# EAGLE design SECUREBRD_001 (EAGLE 7.7.0)

## Sheet 1 of 3
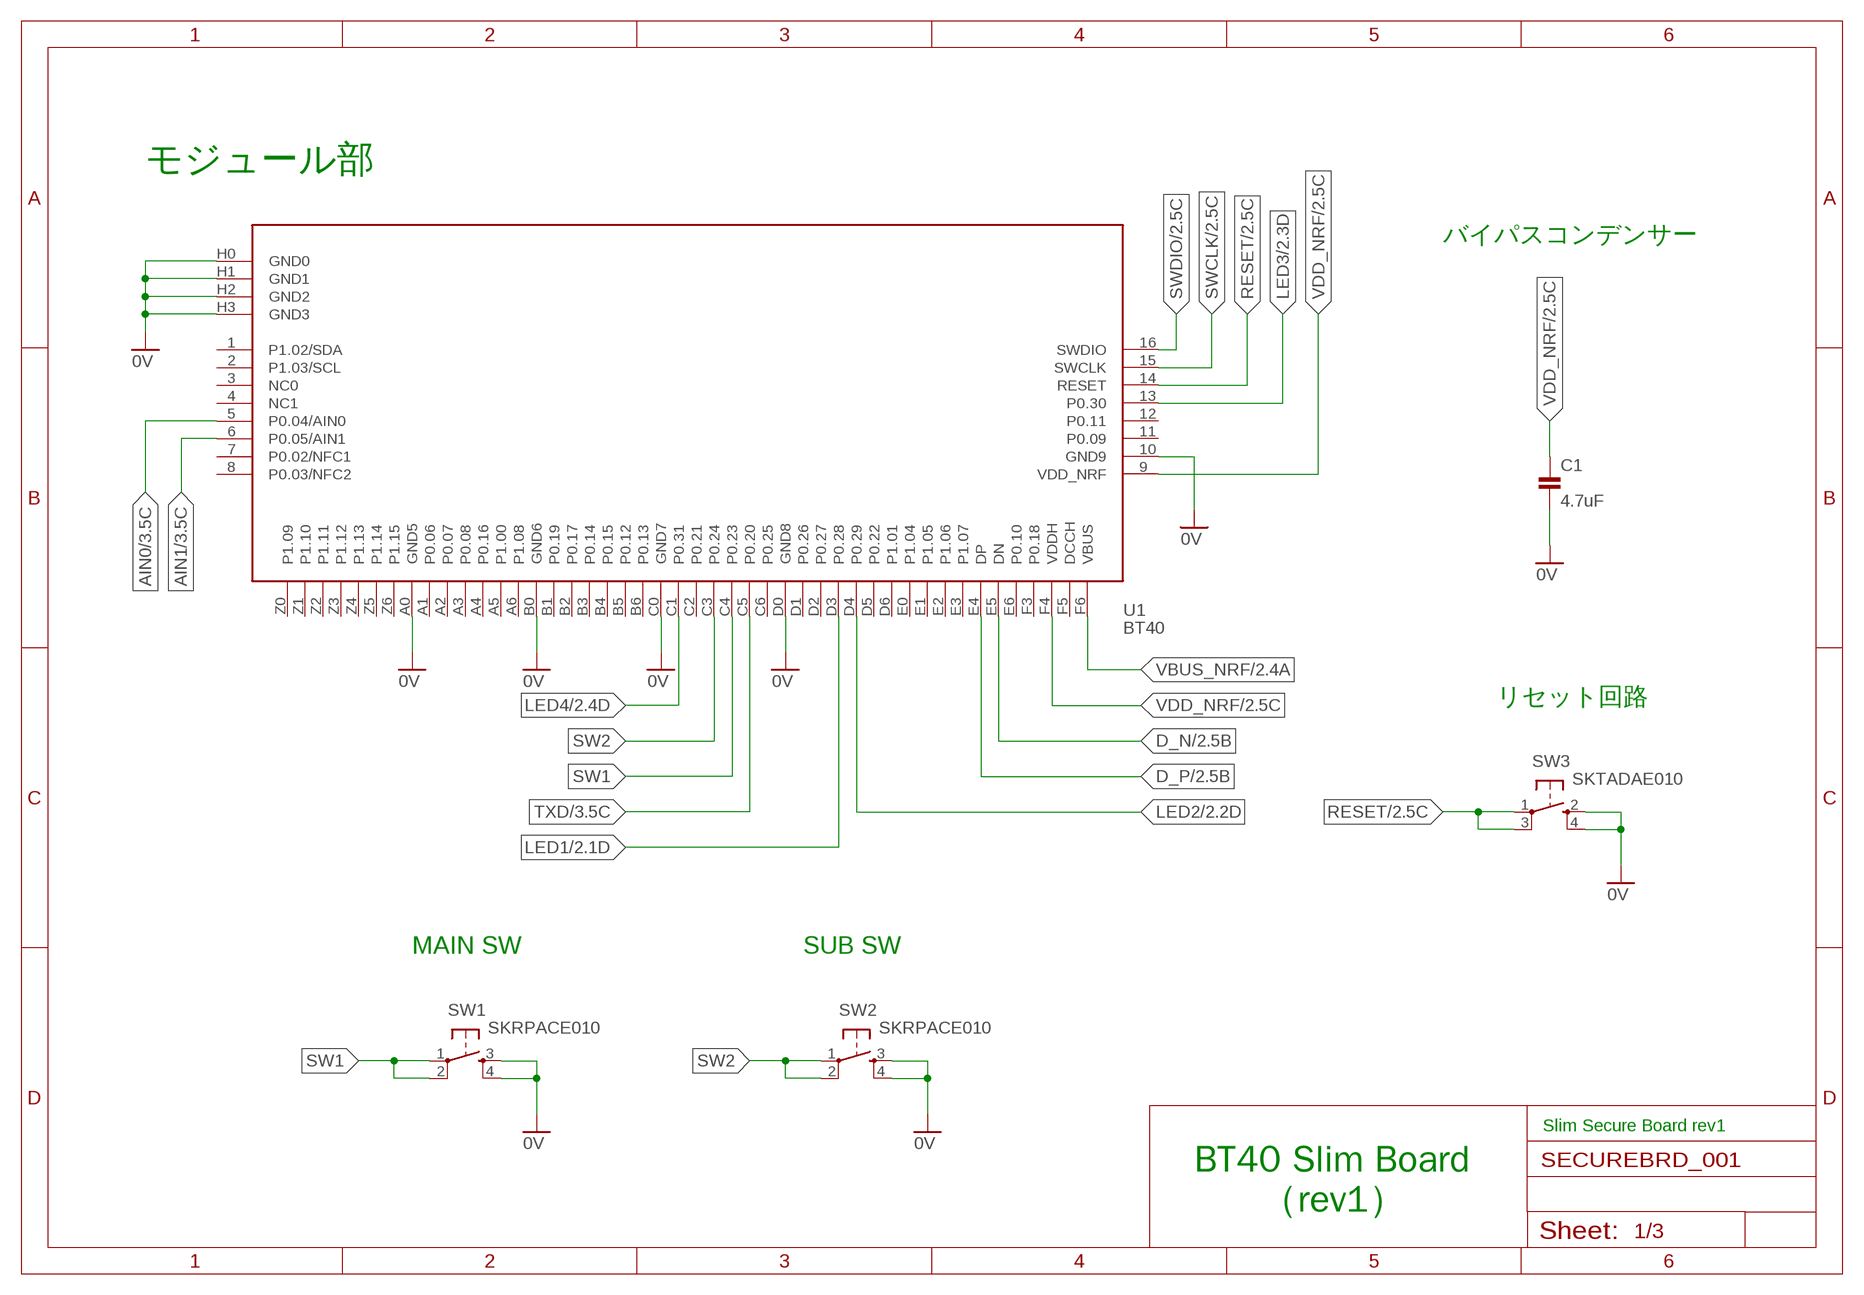
[diagram p0: schematic, sheet 1]

### Parts
C1  4.7uF  CAP_0603  [C0603K]
SW1  SKRPACE010  [SKRPACE010]
SW2  SKRPACE010  [SKRPACE010]
SW3  SKTADAE010  [SKTADAE010]
U1  BT40  [BM40-B_1PRIMARY]

### Nets
0V: C1.2 SW1.3(S) SW1.4(S1) SW2.3(S) SW2.4(S1) SW3.2(S) SW3.4(S1) U1.10(GND9) U1.A0(GND5) U1.B0(GND6) U1.C0(GND7) U1.D0(GND8) U1.H0(GND0) U1.H1(GND1) U1.H2(GND2) U1.H3(GND3) ; also sheet 2,3
AIN0: U1.5(P0.04/AIN0) ; also sheet 3
AIN1: U1.6(P0.05/AIN1) ; also sheet 3
D_N: U1.E5(DN) ; also sheet 2
D_P: U1.E4(DP) ; also sheet 2
LED1: U1.D3(P0.28) ; also sheet 2
LED2: U1.D4(P0.29) ; also sheet 2
LED3: U1.13(P0.30) ; also sheet 2
LED4: U1.C1(P0.31) ; also sheet 2
RESET: SW3.1(P) SW3.3(P1) U1.14(RESET) ; also sheet 2
SW1: SW1.1(P) SW1.2(P1) U1.C4(P0.23)
SW2: SW2.1(P) SW2.2(P1) U1.C3(P0.24)
SWCLK: U1.15(SWCLK) ; also sheet 2
SWDIO: U1.16(SWDIO) ; also sheet 2
TXD: U1.C5(P0.20) ; also sheet 3
VBUS_NRF: U1.F6(VBUS) ; also sheet 2,3
VDD_NRF: C1.1 U1.9(VDD_NRF) U1.F4(VDDH) ; also sheet 2,3
Unconnected: U1.1(P1.02/SDA) U1.2(P1.03/SCL) U1.3(NC0) U1.4(NC1) U1.7(P0.02/NFC1) U1.8(P0.03/NFC2) U1.11(P0.09) U1.12(P0.11) U1.A1(P0.06) U1.A2(P0.07) U1.A3(P0.08) U1.A4(P0.16) U1.A5(P1.00) U1.A6(P1.08) U1.B1(P0.19) U1.B2(P0.17) U1.B3(P0.14) U1.B4(P0.15) U1.B5(P0.12) U1.B6(P0.13) U1.C2(P0.21) U1.C6(P0.25) U1.D1(P0.26) U1.D2(P0.27) U1.D5(P0.22) U1.D6(P1.01) U1.E0(P1.04) U1.E1(P1.05) U1.E2(P1.06) U1.E3(P1.07) U1.E6(P0.10) U1.F3(P0.18) U1.F5(DCCH) U1.Z0(P1.09) U1.Z1(P1.10) U1.Z2(P1.11) U1.Z3(P1.12) U1.Z4(P1.13) U1.Z5(P1.14) U1.Z6(P1.15)

### Notes on the sheet
- モジュール部
- バイパスコンデンサー
- リセット回路
- MAIN SW | SUB SW
- Slim Secure Board rev1
- BT40 Slim Board
        （rev1）

## Sheet 2 of 3
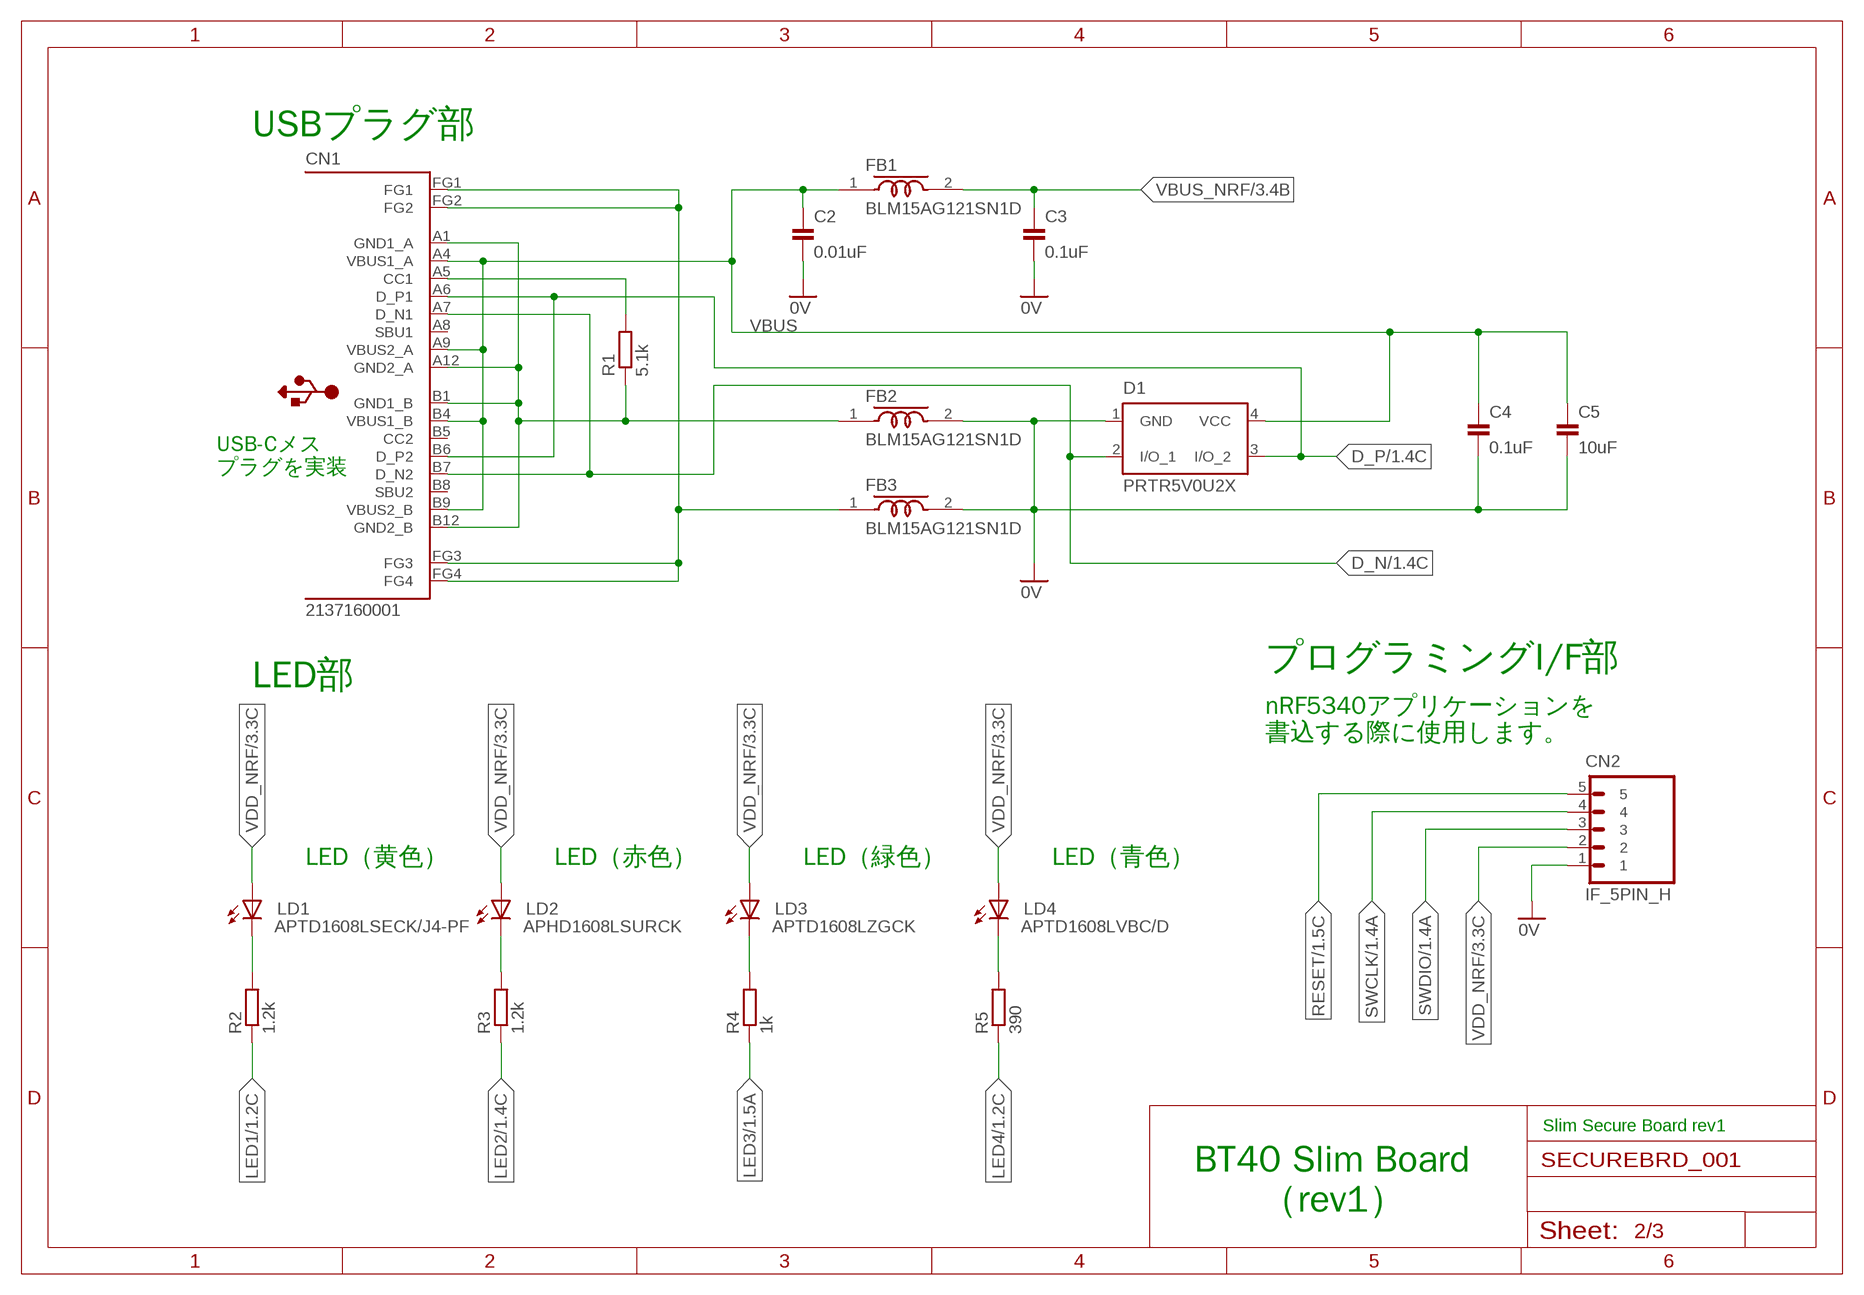
[diagram p1: schematic, sheet 2]

### Parts
C2  0.01uF  CAP_0402K  [C0402K]
C3  0.1uF  CAP_0402K  [C0402K]
C4  0.1uF  CAP_0402K  [C0402K]
C5  10uF  CAP_0603  [C0603K]
CN1  2137160001  [2137160001]
CN2  IF_5PIN_H  [HEADER_5PIN]
D1  PRTR5V0U2X  [SOT143B]
FB1  BLM15AG121SN1D  [C0402K]
FB2  BLM15AG121SN1D  [C0402K]
FB3  BLM15AG121SN1D  [C0402K]
LD1  APTD1608LSECK/J4-PF  [APTD1608]
LD2  APHD1608LSURCK  [APTD1608]
LD3  APTD1608LZGCK  [APTD1608]
LD4  APTD1608LVBC/D  [APTD1608]
R1  5.1k  RESISTOR_0402  [R0402]
R2  1.2k  RESISTOR_0402  [R0402]
R3  1.2k  RESISTOR_0402  [R0402]
R4  1k  RESISTOR_0402  [R0402]
R5  390  RESISTOR_0402  [R0402]

### Nets
0V: C2.2 C3.2 C4.2 C5.2 CN2.1 D1.1(GND) FB2.2 FB3.2 ; also sheet 1,3
D_N: CN1.A7(D_N1) CN1.B7(D_N2) D1.2(I/O_1) ; also sheet 1
D_P: CN1.A6(D_P1) CN1.B6(D_P2) D1.3(I/O_2) ; also sheet 1
FG: CN1.FG1 CN1.FG2 CN1.FG3 CN1.FG4 FB3.1
LED1: R2.1 ; also sheet 1
LED2: R3.1 ; also sheet 1
LED3: R4.1 ; also sheet 1
LED4: R5.1 ; also sheet 1
N$1: LD4.C R5.2
N$2: CN1.A5(CC1) R1.2
N$6: LD3.C R4.2
N$7: LD2.C R3.2
N$8: LD1.C R2.2
RESET: CN2.5 ; also sheet 1
SWCLK: CN2.4 ; also sheet 1
SWDIO: CN2.3 ; also sheet 1
USB_GND: CN1.A1(GND1_A) CN1.A12(GND2_A) CN1.B1(GND1_B) CN1.B12(GND2_B) FB2.1 R1.1
VBUS: C2.1 C4.1 C5.1 CN1.A4(VBUS1_A) CN1.A9(VBUS2_A) CN1.B4(VBUS1_B) CN1.B9(VBUS2_B) D1.4(VCC) FB1.1
VBUS_NRF: C3.1 FB1.2 ; also sheet 1,3
VDD_NRF: CN2.2 LD1.A LD2.A LD3.A LD4.A ; also sheet 1,3
Unconnected: CN1.A8(SBU1) CN1.B5(CC2) CN1.B8(SBU2)

### Notes on the sheet
- USBプラグ部
- USB-Cメス
  プラグを実装
- プログラミングI/F部
- LED部
- nRF5340アプリケーションを
  書込する際に使用します。
- LED（黄色） | LED（赤色） | LED（緑色） | LED（青色）
- Slim Secure Board rev1
- BT40 Slim Board
        （rev1）

## Sheet 3 of 3
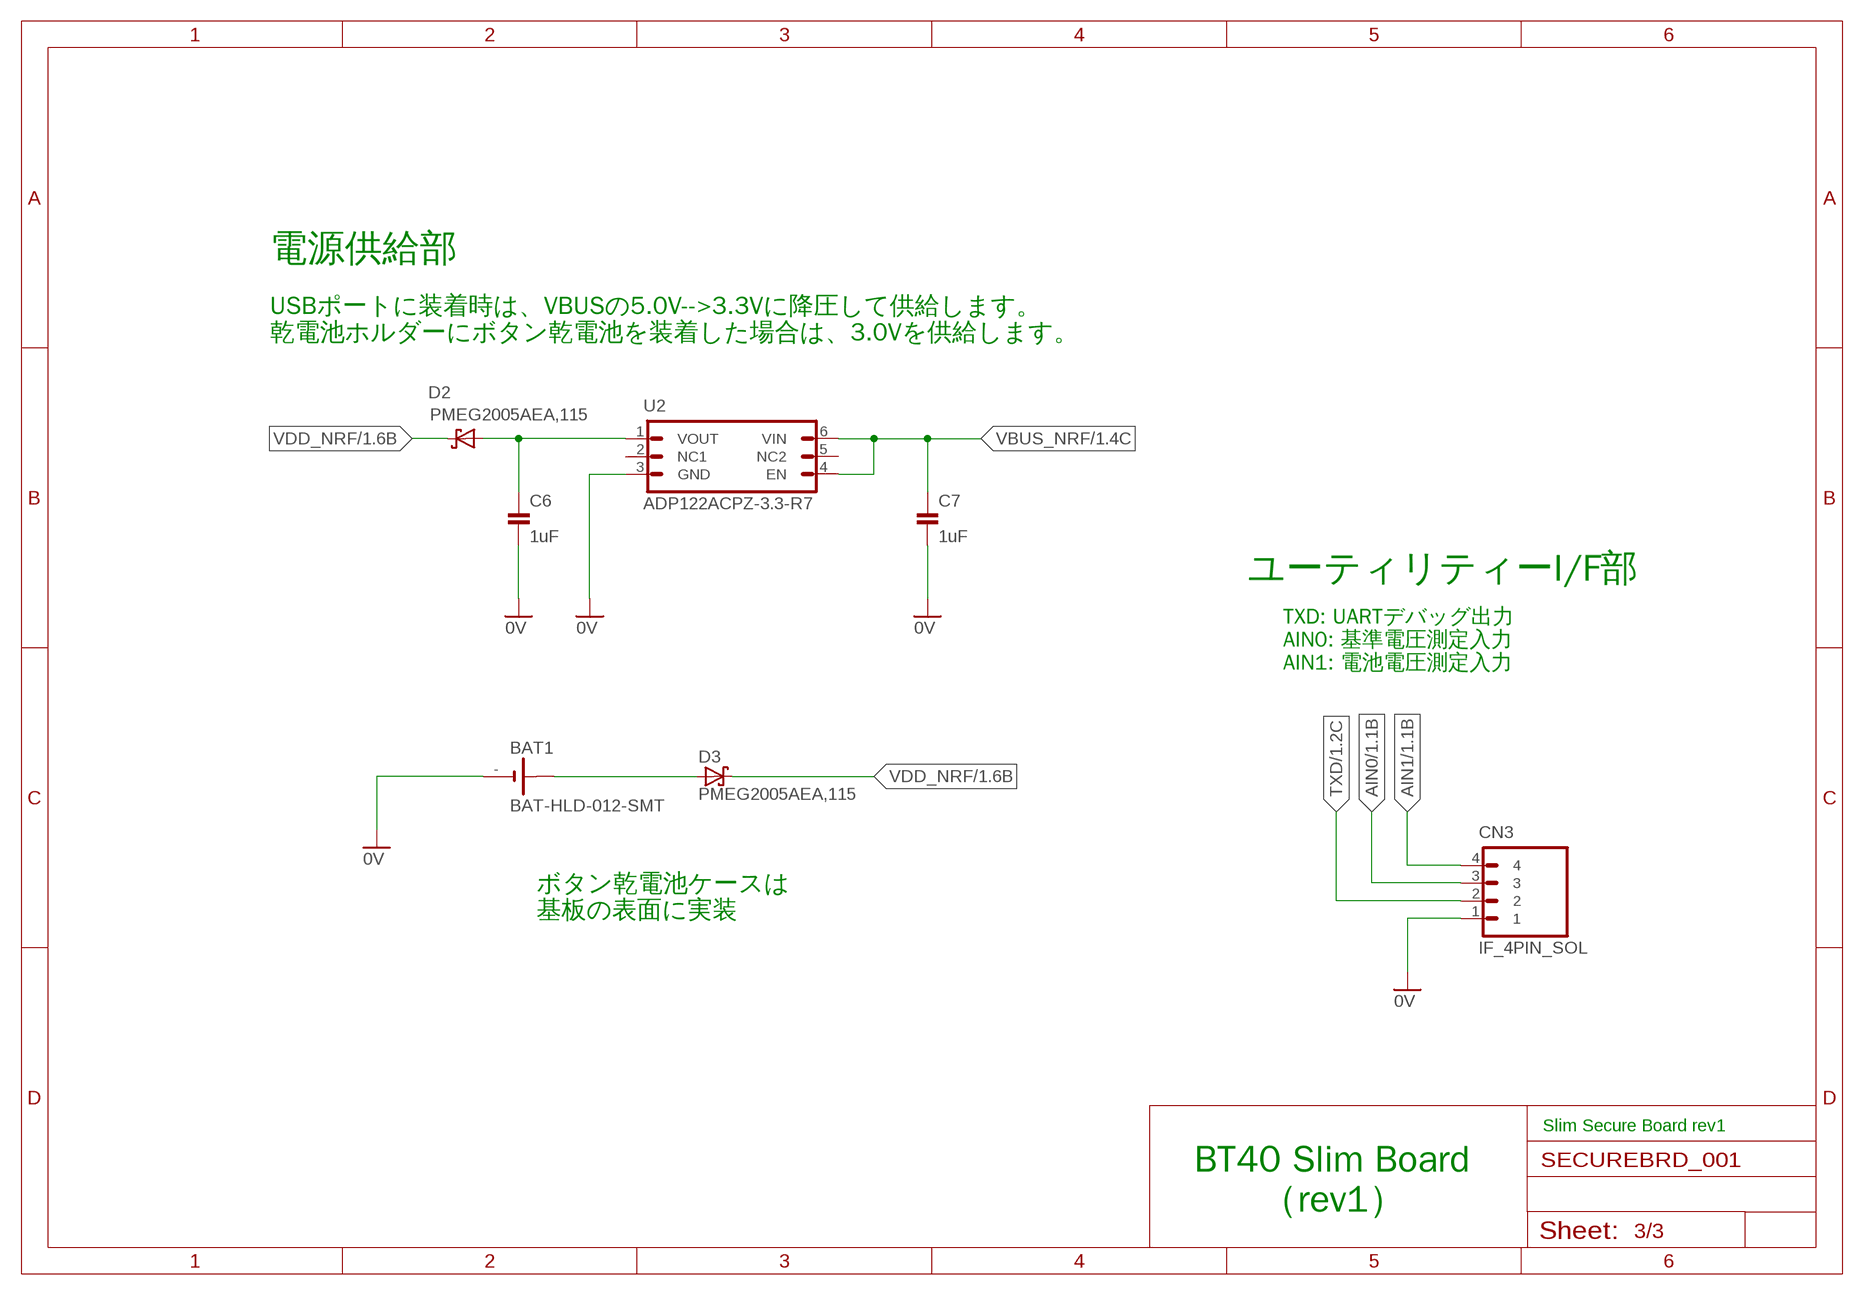
[diagram p2: schematic, sheet 3]

### Parts
BAT1  BAT-HLD-012-SMT  [BAT-HLD-012-SMT]
C6  1uF  CAP_0603  [C0603K]
C7  1uF  CAP_0603  [C0603K]
CN3  IF_4PIN_SOL  [SOLPAD_4PIN]
D2  PMEG2005AEA,115  [SOD323-W]
D3  PMEG2005AEA,115  [SOD323-W]
U2  ADP122ACPZ-3.3-R7  [6-LFCSP_UD]

### Nets
0V: BAT1.- C6.2 C7.2 CN3.1 U2.3(GND) ; also sheet 1,2
AIN0: CN3.3 ; also sheet 1
AIN1: CN3.4 ; also sheet 1
N$3: C6.1 D2.A U2.1(VOUT)
N$5: BAT1.+@2(+) D3.A
TXD: CN3.2 ; also sheet 1
VBUS_NRF: C7.1 U2.4(EN) U2.6(VIN) ; also sheet 1,2
VDD_NRF: D2.C D3.C ; also sheet 1,2
Unconnected: U2.2(NC1) U2.5(NC2)

### Notes on the sheet
- 電源供給部
- USBポートに装着時は、VBUSの5.0V-->3.3Vに降圧して供給します。
  乾電池ホルダーにボタン乾電池を装着した場合は、3.0Vを供給します。
- ユーティリティーI/F部
- TXD: UARTデバッグ出力
  AIN0: 基準電圧測定入力
  AIN1: 電池電圧測定入力
- ボタン乾電池ケースは
  基板の表面に実装
- Slim Secure Board rev1
- BT40 Slim Board
        （rev1）

## Library data of the parts
BAT1 = Connectors:BAT-HLD-012-SMT: ボタン電池ホルダー(CR1216/1225)
C1-C7 = Parts:CAP: コンデンサー
CN1 = Connectors:2137160001: USB Type C Connectors Receptacle USB 2.0 16 Contact
CN2 = Connectors:IF_5PIN: 5-pin インターフェース
CN3 = Connectors:IF_4PIN: 4-pin インターフェース
D1 = Parts:PRTR5V0U2X: ESD protection diode
D2 D3 = Parts:PMEG2005: ショットキーダイオード If - 順電流: 500 mA Vrrm - 繰返し逆電圧: 20 V Vf - 順電圧: 0.39 V Ifsm - 順方向サージ電流: 10 A 最低動作温度: - 65 C 最高動作温度: + 150 C
FB1-FB3 = Parts:BLM15AG: フェライトビーズ EMIFIL®
LD1 LD3 LD4 = Parts:APTD1608: 発光ダイオード
LD2 = Parts:APHD1608: 発光ダイオード
R1-R5 = Parts:RESISTOR: 抵抗器
SW1 SW2 = Parts:SKRPACE010: 表面実装用タクトスイッチ ４．２×３．２ｍｍ小型重作動力タイプ ・作動力：２．５５Ｎ ・操作方向：垂直 ・移動量：０．２ｍｍ ・動作寿命：５０，０００ｃｙｃｌｅｓ （５ｍＡ ５ＶＤＣ） ・初期接触抵抗：最大５００ｍΩ
SW3 = Parts:SKTADAE010: 表面実装用タクトスイッチ 2.6×1.6ｍｍ小型重作動力タイプ ・作動力：2.4 N ・操作方向：垂直 ・移動量：0.11 mm ・定格：50 mA 12 VDC
U1 = Modules:BT40: BLE 5.2, 802.15.4 Modules ・nRF5340 QKAA, dual core ARM® Cortex M33 ・128/64 MHz Cortex M33 with FPU and DSP instructions ・1MB flash, 512KB RAM ・DC-DC converter, inductors for VDD, VDDH on board. ・Direct powered by Lithium batteries or USB supply (up to 5.5V)
U2 = ICs:ADP122: Low Quiescent Current, CMOS Linear Regulator Input voltage supply range: 2.3 V to 5.5 V 300 mA maximum output current Very low dropout voltage: 85 mV at 300 mA load Low quiescent current: 45 μA at no load

## Board
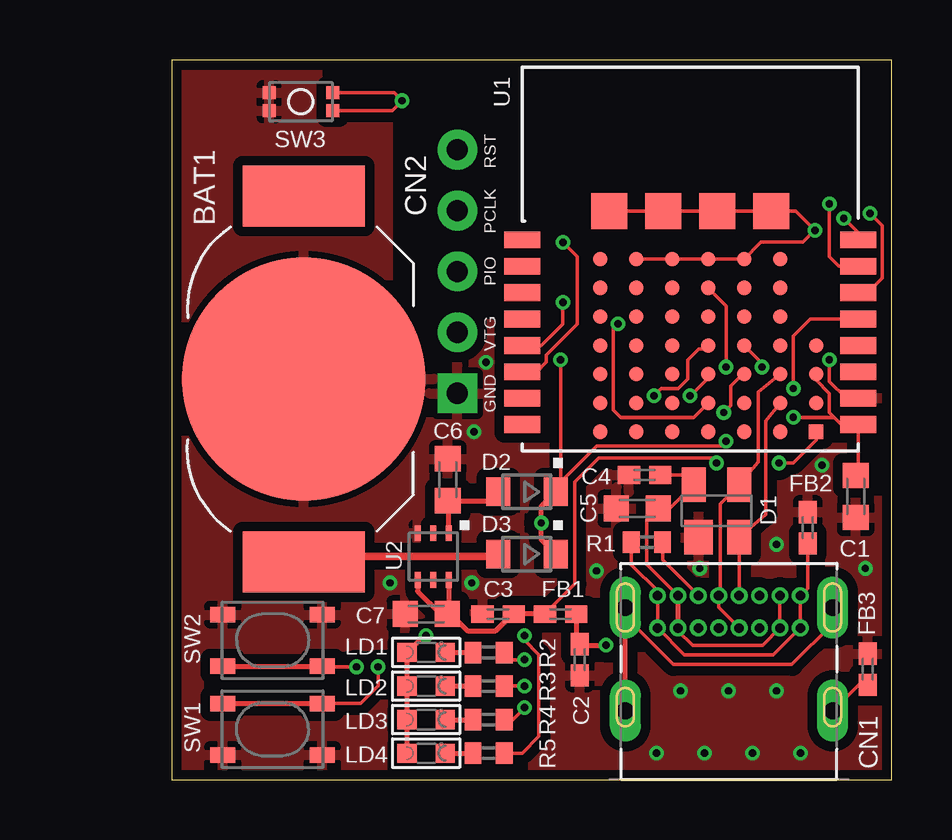
[diagram p3: board, top side]
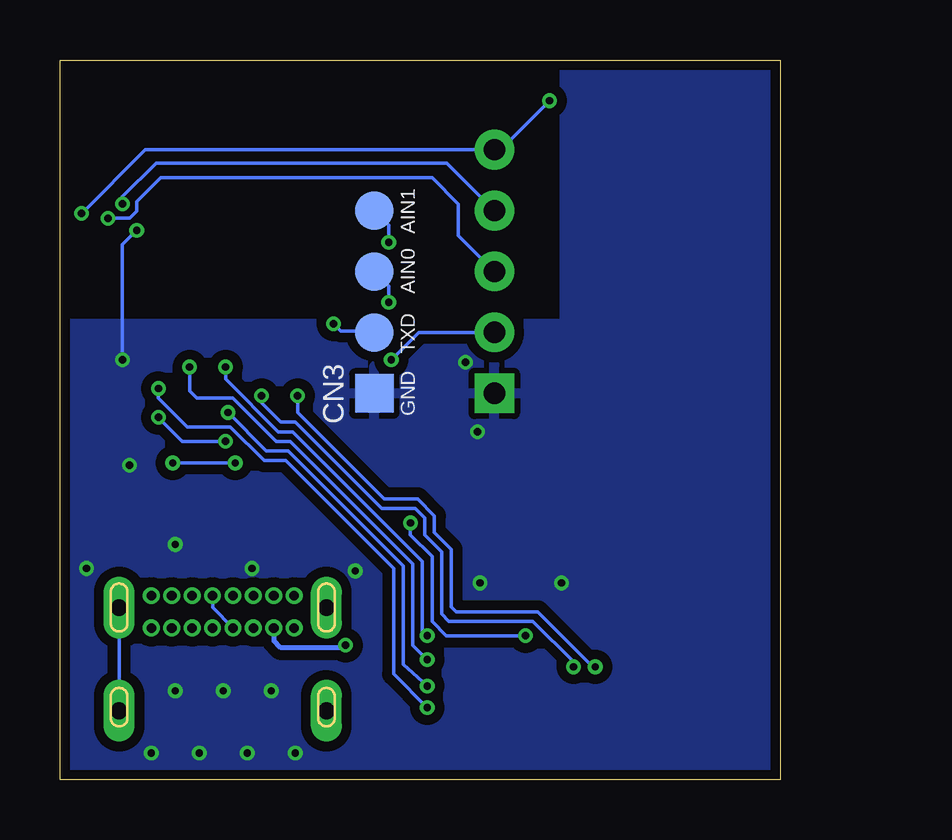
[diagram p4: board, bottom side, seen from below]

Size 30 x 30 mm. Coordinates in mm from the lower left corner, seen from the top.
Outline: 0,0 30,0 30,30 0,30 0,0
Copper layers (1*16): Top 0.035mm / dielectric 1.5mm / Bottom 0.035mm
Design rules "SeeedStudio_2layer_DRU_no_angle_20140221 *": minimum track width 6mil, minimum drill 12mil, track to track 6mil, track to pad 6mil, pad to pad 5mil, via to via 6mil, smd to smd 0mil, copper to edge 10mil, drill to drill 10mil, minimum pad ring 4mil, minimum via ring 6mil, stop-mask expansion 2mil, vias tented up to drill 100mil, thermal gap 10mil

### Footprints (pad centres in the part's own frame; a part is rotated, then mirrored left to right if it is on the bottom)
BAT-HLD-012-SMT = smd 2.54 x 5.08: +@1 -7.62,0; +@2 7.62,0 | smd 10.16 x 10.16: - 0,0
C0603K = smd 1.05 x 1.08: 1 -0.875,0; 2 0.875,0
C0402K = smd 0.925 x 0.74: 1 -0.65,0; 2 0.65,0
2137160001 = drill 0.4 pad 0.7: A1 -2.975,0.5; A4 -2.125,0.5; A5 -1.275,0.5; A6 -0.425,0.5; A7 0.425,0.5; A8 1.275,0.5; A9 2.125,0.5; A12 2.975,0.5; B1 2.975,-0.85; B4 2.125,-0.85; B5 1.275,-0.85; B6 0.425,-0.85; B7 -0.425,-0.85; B8 -1.275,-0.85; B9 -2.125,-0.85; B12 -2.975,-0.85 | drill 0.7 pad 1.3 long: FG1 -4.32,0; FG2 -4.32,-4.3; FG3 4.32,0; FG4 4.32,-4.3
HEADER_5PIN = drill 0.889 pad 1.651 square: 1 0,0 | drill 0.889 pad 1.651: 2 2.54,0; 3 5.08,0; 4 7.62,0; 5 10.16,0
SOLPAD_4PIN = smd 1.6 x 1.6: 1 0,0; 2 2.54,0; 3 5.08,0; 4 7.62,0
SOT143B = smd 1.2 x 1.44: 1 -0.75,-1.1 | smd 1 x 1.44: 2 0.95,-1.1; 3 0.95,1.1; 4 -0.95,1.1
SOD323-W = smd 1 x 1.2: A 1.2,0; C -1.2,0
APTD1608 = smd 0.8 x 0.8: A -0.8,0; C 0.8,0
R0402 = smd 0.7 x 0.9: 1 -0.65,0; 2 0.65,0
SKRPACE010 = smd 1.05 x 0.65: 1 -2.075,1.075; 2 2.075,1.075; 3 -2.075,-1.075; 4 2.075,-1.075
SKTADAE010 = smd 0.55 x 0.55: 1 -1.325,0.375; 2 1.325,0.375; 3 -1.325,-0.375; 4 1.325,-0.375
BM40-B_1PRIMARY = smd 1.5 x 0.7: 1 0,8.8; 2 0,7.7; 3 0,6.6; 4 0,5.5; 5 0,4.4; 6 0,3.3; 7 0,2.2; 8 0,1.1; 9 14,1.1; 10 14,2.2; 11 14,3.3; 12 14,4.4; 13 14,5.5; 14 14,6.6; 15 14,7.7; 16 14,8.8 | smd 0.6 x 0.6: A0 4.75,8; A1 4.75,6.8; A2 4.75,5.6; A3 4.75,4.4; A4 4.75,3.2; A5 4.75,2; A6 4.75,0.8; B0 6.25,8; B1 6.25,6.8; B2 6.25,5.6; B3 6.25,4.4; B4 6.25,3.2; B5 6.25,2; B6 6.25,0.8; C0 7.75,8; C1 7.75,6.8; C2 7.75,5.6; C3 7.75,4.4; C4 7.75,3.2; C5 7.75,2; C6 7.75,0.8; D0 9.25,8; D1 9.25,6.8; D2 9.25,5.6; D3 9.25,4.4; D4 9.25,3.2; D5 9.25,2; D6 9.25,0.8; E0 10.75,8; E1 10.75,6.8; E2 10.75,5.6; E3 10.75,4.4; E4 10.75,3.2; E5 10.75,2; E6 10.75,0.8; F3 12.25,4.4; F4 12.25,3.2; F5 12.25,2; F6 12.25,0.8; Z0 3.25,8; Z1 3.25,6.8; Z2 3.25,5.6; Z3 3.25,4.4; Z4 3.25,3.2; Z5 3.25,2; Z6 3.25,0.8 | smd 1.5 x 1.5: H0 3.625,10; H1 5.875,10; H2 8.125,10; H3 10.375,10
6-LFCSP_UD = smd 0.25 x 0.65: 1 -0.65,-0.975; 2 0,-0.975; 3 0.65,-0.975; 4 0.65,0.975; 5 0,0.975; 6 -0.65,0.975

### Placement (x,y rotation side)
BAT1  5.5,16.7 270 top
C1  28.5,11.8 270 top
C2  17,5 270 top
C3  13.6,6.9 180 top
C4  19.7,12.7 180 top
C5  19.4,11.3 180 top
C6  11.5,12.5 90 top
C7  10.6,6.9 180 top
CN1  23.22,7.17 0 top
CN2  11.9,16.1 90 top
CN3  16.9,16.1 90 bottom
D1  22.7,11.2 0 top
D2  14.8,12 180 top
D3  14.8,9.4 180 top
FB1  16.2,6.9 180 top
FB2  26.5,10.5 90 top
FB3  29,4.6 90 top
LD1  10.6,5.3 0 top
LD2  10.6,3.9 0 top
LD3  10.6,2.5 0 top
LD4  10.6,1.1 0 top
R1  19.8,9.9 0 top
R2  13.2,5.3 180 top
R3  13.2,3.9 180 top
R4  13.2,2.5 180 top
R5  13.2,1.1 180 top
SW1  4.2,2.1 0 top
SW2  4.2,5.8 180 top
SW3  5.38,28.26 180 top
U1  14.6,13.7 0 top
U2  10.9,9.3 180 top

### Tracks (layer width: path | path; a pad name or v marks a point on that pad's centre or on a via)
0V  (via drill 0.3)
  Top 0.152: U1.A0 U1.B0 U1.C0 U1.D0 24.55,22.4 26.3,22.4 v26.8,22.9 26,23.7 U1.H3 U1.H2 U1.H1 U1.H0 | v27.4,17.5 27.4,16.6 28.1,15.9 U1.10
  Bottom 0.152: v26.8,22.9 27.4,22.3 v27.4,17.5
  other vias: 22,8.8 28.9,8.8 12.5,8.2 17.7,8.7 25.2,9.8 22.2,1.1 26.2,1.1 20.2,1.1 24.2,1.1 23.2,3.7 25.2,3.7 21.2,3.7 27.1,13.1 13.1,17.4 12.6,14.5 9.1,8.2
  pour Bottom (isolate 0.406, rank 3): 9,31 9,19 31,19 31,-1 -1,-1 -1,31
  pour Top (isolate 0.406, rank 3): -2,32 9,32 9,19 32,19 32,-2 -2,-2
AIN0  (via drill 0.3)
  Top 0.152: U1.5 15.4,18.1 16.3,19 v16.3,19.9
  Bottom 0.152: CN3.3 16.3,20.58 v16.3,19.9
AIN1  (via drill 0.3)
  Top 0.152: U1.6 15.2,17 15.6,17.4 15.6,17.7 16.9,19 16.9,21.8 v16.3,22.4
  Bottom 0.152: CN3.4 16.3,23.12 v16.3,22.4
D_N
  Top 0.152: U1.E5 24.75,14.95 24.75,11.05 D1.2 CN1.A7
  Bottom 0.152: CN1.B7 23.64,7.17 CN1.A7
D_P
  Top 0.152: U1.E4 24.45,16.15 24.45,13.25 D1.3 22.85,11.5 22.85,7.73 CN1.A6 22.79,7.17 CN1.B6
FG
  Top 0.152: CN1.FG1 18.9,6.8 20.9,4.8 25.84,4.8 27.54,6.5 CN1.FG3 | FB3.1 28.62,3.95 CN1.FG4
  Top 0.203: CN1.FG2 CN1.FG1
  Bottom 0.152: CN1.FG4 CN1.FG3
LED1  (via drill 0.3)
  Top 0.152: 23.85,18.05 U1.D3 24.6,17.35 v24.6,17.2 | v14.7,5 14.15,5 R2.1
  Bottom 0.152: v14.7,5 15.3,5.6 15.3,9 20.4,14.1 21,14.1 22.8,15.9 24.3,15.9 24.6,16.2 v24.6,17.2
LED2  (via drill 0.3)
  Top 0.152: U1.D4 23.8,16.9 23.3,16.4 23.3,15.6 v23,15.3 | R3.1 v14.7,3.9
  Bottom 0.152: v14.7,3.9 15.7,4.8 15.7,8.9 20.5,13.7 21.4,13.7 v23,15.3
LED3  (via drill 0.3)
  Top 0.152: U1.13 26.6,19.2 25.9,18.5 v25.9,16.3 | R4.1 14.2,2.5 v14.7,3
  Bottom 0.152: v25.9,16.3 25.9,15.9 24.7,14.7 22.9,14.7 21.5,13.3 20.6,13.3 16.1,8.8 16.1,4.4 v14.7,3
LED4  (via drill 0.3)
  Top 0.152: R5.1 14.6,1.1 15.3,1.8 15.3,5.2 14.7,5.8 v14.7,6 | v23.1,17.2 23.1,19.75 U1.C1
  Bottom 0.152: v14.7,6 14.9,6.2 14.9,9.1 20.3,14.5 20.9,14.5 23.1,16.7 v23.1,17.2
N$1
  Top 0.203: LD4.C R5.2
N$2
  Top 0.152: CN1.A5 20.45,9.16 R1.2
N$3
  Top 0.203: U2.1 11.55,11.57 C6.1 13.22,11.62 D2.A
N$5
  Top 0.305: D3.A 13.5,9.3 7.2,9.3 6.98,9.08 BAT1.+@2
N$6
  Top 0.203: LD3.C R4.2
N$7
  Top 0.203: LD2.C R3.2
N$8
  Top 0.203: LD1.C R2.2
RESET  (via drill 0.3)
  Top 0.152: U1.14 29,20.3 29.6,20.9 29.6,23.1 v29.1,23.6 | SW3.3 9.27,28.63 v9.6,28.3 9.18,27.88 SW3.1
  Bottom 0.152: v29.1,23.6 26.44,26.26 CN2.5 11.64,26.26 v9.6,28.3
SW1  (via drill 0.3)
  Top 0.152: v21.6,16 22.35,16.75 U1.C4 | v8.6,4.7 8.6,3.9 7.88,3.17 SW1.2
  Top 0.203: SW1.1 SW1.2
  Bottom 0.152: v8.6,4.7 8.6,4.9 10.3,6.6 13.8,6.6 14.1,6.9 14.1,9.5 14.8,10.2 14.8,10.9 15.2,11.3 16.6,11.3 20.2,14.9 20.8,14.9 21.6,15.7 v21.6,16
SW2  (via drill 0.3)
  Top 0.152: U1.C3 22.35,17.95 21.95,17.95 21.5,17.5 21.5,16.7 21.1,16.3 20.4,16.3 v20.1,16 | 6.33,4.72 SW2.1 6.3,4.7 v7.7,4.7
  Top 0.203: SW2.2 SW2.1
  Bottom 0.152: v7.7,4.7 7.8,4.7 10.1,7 13.5,7 13.7,7.2 13.7,9.6 14.4,10.3 14.4,11 15.1,11.7 16.5,11.7 20.1,15.3 v20.1,16
SWCLK  (via drill 0.3)
  Top 0.152: U1.15 27.8,21.4 27.4,21.8 v27.4,24
  Bottom 0.152: v27.4,24 27.4,24.3 26,25.7 13.88,25.7 CN2.4
SWDIO  (via drill 0.3)
  Top 0.152: U1.16 28.6,22.8 v28,23.4
  Bottom 0.152: v28,23.4 27.1,23.4 26.8,23.7 26.8,24.1 25.8,25.1 14.5,25.1 13.4,24 13.4,22.68 CN2.3
TXD  (via drill 0.3)
  Top 0.152: U1.C5 21.75,15.1 18.7,15.1 18.4,15.4 18.4,18.8 v18.6,19
  Bottom 0.152: CN3.2 16.96,18.7 18.3,18.7 v18.6,19
USB_GND
  Top 0.152: FB2.1 26.5,7.98 CN1.A12 CN1.B1 25.07,5.2 21.36,5.2 CN1.B12 CN1.A1 20.24,7.86 19.15,8.95 R1.1
VBUS  (via drill 0.3)
  Top 0.152: CN1.A9 CN1.B4 24.62,5.6 21.7,5.6 21.09,6.21 CN1.B9 | CN1.A4 19.8,8.96 19.8,10.82 C5.1 20.75,11.3 D1.4 21.35,12.7 C4.1
  Top 0.203: CN1.A4 CN1.B9 | FB1.1 16.85,5.8 C2.1 17.05,5.6 v18.1,5.6
  Bottom 0.152: 21.09,6.21 CN1.B9
  Bottom 0.203: CN1.B9 21.09,5.79 20.8,5.5 18.2,5.5 v18.1,5.6
VBUS_NRF  (via drill 0.3)
  Top 0.152: v25.3,13.2 25.9,13.2 26.85,14.15 U1.F6 | FB1.2 16.8,8.15 16.8,12.4 17.8,13.4 22.5,13.4 v22.7,13.2
  Top 0.203: U2.6 11.55,6.97 | 11.55,6.97 C7.1 11.2,6.9 10.25,7.85 U2.4 | FB1.2 C3.1 14.2,6.9 13.5,6.2 12.32,6.2 11.55,6.97
  Bottom 0.152: v22.7,13.2 v25.3,13.2
VDD_NRF  (via drill 0.3)
  Top 0.152: C1.1 28.6,12.78 U1.9 27.9,14.8 27.75,14.95 27.6,15.1 | 27.6,15.1 27.4,15.3 27.4,16.1 26.85,16.65 U1.F4 | v23.1,14.1 22.9,13.9 17.7,13.9 16,12.2 D2.C 16.2,12.2 v16.2,17.5 | D3.C 16,9.1 | v25.9,15.1 27.6,15.1
  Top 0.203: 16,11.5 D2.C 15.4,11.4 v15.4,10.7 15.4,10 D3.C | LD4.A LD3.A LD2.A LD1.A 10.5,6 v10.6,6
  Bottom 0.152: CN2.2 15.06,18.64 v16.2,17.5 | v10.6,6 13.9,6 14.5,6.6 14.5,9.3 15.4,10.2 v15.4,10.7 | v23.1,14.1 24.9,14.1 v25.9,15.1

### Text on the board
tPlace: RST | PCLK | PIO | VTG | GND
bPlace: AIN1 | AIN0 | TXD | GND